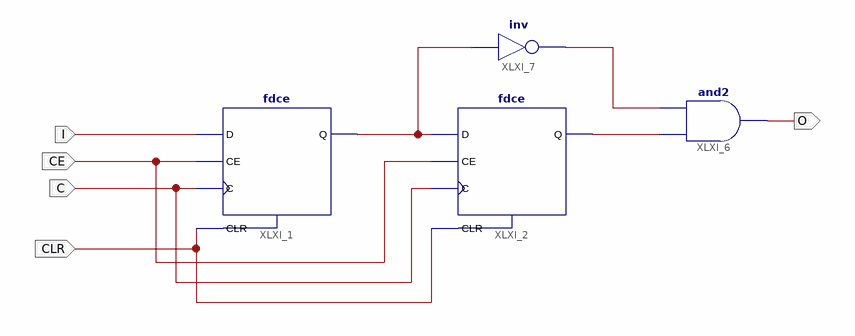
[diagram p0: schematic sheet 1]
// Xilinx ISE schematic falling_edge_detector.sch (spartan6) as structural Verilog: 4 symbols, 5 ports
module falling_edge_detector (
  input  I,
  input  CE,
  input  CLR,
  input  C,
  output O
);

  wire XLXN_2, XLXN_29, XLXN_30;

  fdce XLXI_1 (.C(C), .CE(CE), .CLR(CLR), .D(I), .Q(XLXN_29));
  fdce XLXI_2 (.C(C), .CE(CE), .CLR(CLR), .D(XLXN_29), .Q(XLXN_2));
  and XLXI_6 (O, XLXN_2, XLXN_30);
  not XLXI_7 (XLXN_30, XLXN_29);
endmodule
